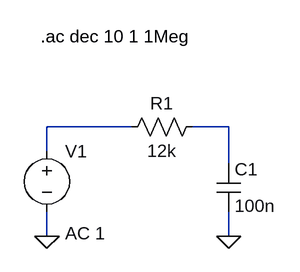
[diagram p0: schematic LPF.asc]
LPF.asc, the LTspice schematic file:
Version 4
SHEET 1 880 680
WIRE 48 128 -64 128
WIRE 176 128 128 128
WIRE -64 160 -64 128
WIRE 176 176 176 128
WIRE -64 272 -64 240
WIRE 176 272 176 240
FLAG 176 272 0
FLAG -64 272 0
SYMBOL res 144 112 R90
WINDOW 0 0 56 VBottom 2
WINDOW 3 32 56 VTop 2
SYMATTR InstName R1
SYMATTR Value 12k
SYMBOL cap 160 176 R0
SYMATTR InstName C1
SYMATTR Value 100n
SYMBOL voltage -64 144 R0
WINDOW 123 24 124 Left 2
WINDOW 39 0 0 Left 2
SYMATTR InstName V1
SYMATTR Value ""
SYMATTR Value2 AC 1
TEXT -72 8 Left 2 !.ac dec 10 1 1Meg

The netlist it stands for:
* LPF.asc
R1 N002 N001 12k
C1 N002 0 100n
V1 N001 0 AC 1
.ac dec 10 1 1Meg
.backanno
.end